# Altium schematic sheet RPL_POWER_24V.SchDoc: POWER MANAGMENT
size A; DrawnBy: Seyed Omid Hasanli; Organization: RPL; Revision: 1
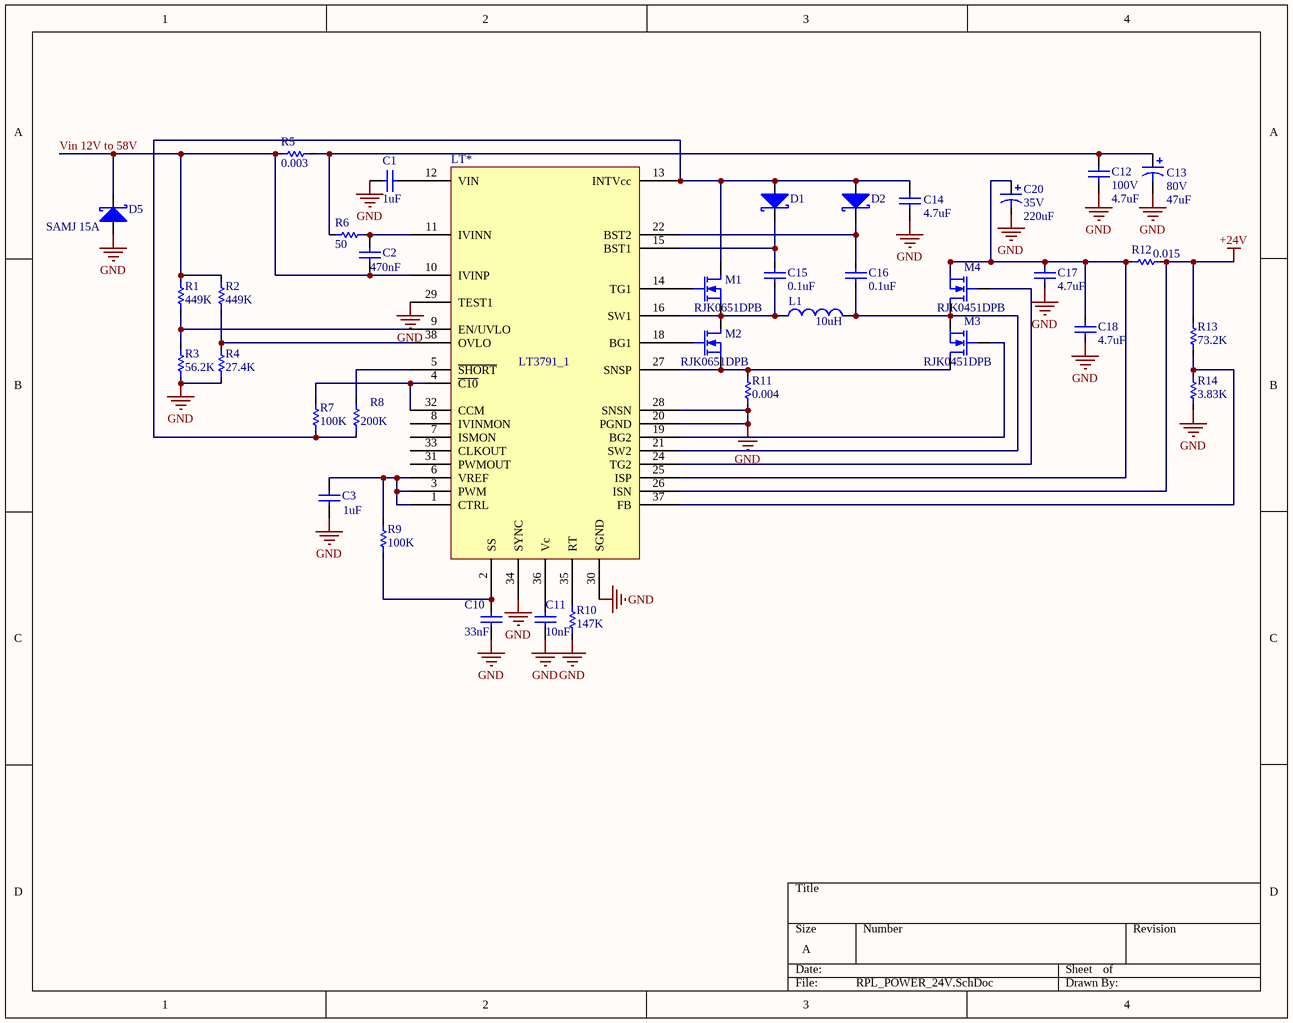
[diagram p0: RPL_POWER_24V.SchDoc]

## Parts
C1  value 1uF  [C1206]  (hidden comment: Cap Semi)
C2  value 470nF  [C1206]  (hidden comment: Cap Semi)
C3  value 1uF  [C1206]  (hidden comment: Cap Semi)
C10  value 33nF  [C1206]  (hidden comment: Cap Semi)
C11  value 10nF  [C1206]  (hidden comment: Cap Semi)
C12  100V  value 4.7uF  [C1206]
C13  80V  value 47uF  [C0805]
C14  value 4.7uF  [C1206]  (hidden comment: Cap Semi)
C15  value 0.1uF  (hidden comment: Cap)
C16  value 0.1uF  (hidden comment: Cap)
C17  value 4.7uF  (hidden comment: 50V)
C18  value 4.7uF  (hidden comment: 50V)
C20  35V  value 220uF
D1  Diod  (value not drawn)
D2  Diod  (value not drawn)
D5  SAMJ 15A
L1  value 10uH  (hidden comment: Inductor)
LT*  LT3791_1
M1  RJK0651DPB
M2  RJK0651DPB
M3  RJK0451DPB
M4  RJK0451DPB
R1  value 449K  (hidden comment: Res)
R2  value 449K  (hidden comment: Res)
R3  value 56.2K  (hidden comment: Res)
R4  value 27.4K  (hidden comment: Res)
R5  value 0.003  (hidden comment: Res)
R6  value 50  (hidden comment: Res)
R7  value 100K  (hidden comment: Res)
R8  value 200K  (hidden comment: Res)
R9  value 100K  (hidden comment: Res)
R10  value 147K  (hidden comment: 200KHz)
R11  value 0.004  (hidden comment: Res)
R12  value 0.015  (hidden comment: Res)
R13  value 73.2K  (hidden comment: Res)
R14  value 3.83K  (hidden comment: Res)

## Nets
+24V: LT*.26(ISN) R12.2 R13.2
GND: C1.2 C3.1 C10.1 C11.1 C12.1 C13.2 C14.1 C17.1 C18.1 C20.2 D5.1(A) LT*.20(PGND) LT*.28(SNSN) LT*.29(TEST1) LT*.30(SGND) LT*.34(SYNC) R3.1 R4.1 R10.1 R11.1 R14.1
Vin 12V to 58V: C2.1 D5.3(K) LT*.10(IVINP) R1.2 R2.2 R5.1
NetC1_1: C1.1 LT*.12(VIN)
NetC2_2: C2.2 LT*.11(IVINN) R6.2
NetC3_2: C3.2 LT*.1(CTRL) LT*.3(PWM) LT*.6(VREF) R9.2
NetC10_2: C10.2 LT*.2(SS) R9.1
NetC11_2: C11.2 LT*.36(Vc)
NetC12_2: C12.2 C13.1 R5.2 R6.1
NetC14_2: C14.2 D1.1(A) D2.1(A) LT*.13(INTVcc) M1.1(D) R7.1 R8.1
NetC15_1: C15.1 L1.1 LT*.16(SW1) M1.3(S) M2.1(D)
NetC15_2: C15.2 D1.3(K) LT*.15(BST1)
NetC16_1: C16.1 L1.2 LT*.21(SW2) M3.3(S) M4.1(D)
NetC16_2: C16.2 D2.3(K) LT*.22(BST2)
NetC17_2: C17.2 C18.2 C20.1 LT*.25(ISP) M4.3(S) R12.1
NetLT*_4: LT*.4(~{C10}) LT*.32(CCM) R7.2
NetLT*_5: LT*.5(~{SHORT}) R8.2
NetLT*_9: LT*.9(EN/UVLO) R1.1 R3.2
NetLT*_14: LT*.14(TG1) M1.2(G)
NetLT*_18: LT*.18(BG1) M2.2(G)
NetLT*_19: LT*.19(BG2) M3.2(G)
NetLT*_24: LT*.24(TG2) M4.2(G)
NetLT*_27: LT*.27(SNSP) M2.3(S) M3.1(D) R11.2
NetLT*_35: LT*.35(RT) R10.2
NetLT*_37: LT*.37(FB) R13.1 R14.2
NetLT*_38: LT*.38(OVLO) R2.1 R4.2

Not connected (* = marked no-connect by the designer): LT* 7(ISMON) 8(IVINMON) 31(PWMOUT) 33(CLKOUT)

## Library data of the parts
C1-C3 C10-C12 C14 = Cap Semi: Capacitor (Semiconductor SIM Model); Published: 8-Jun-2000; LatestRevisionDate: 29-May-2009; LatestRevisionNote: IPC-7351 Footprint Added.; PackageReference: C1206; Publisher: Altium Limited; PackageDescription: Chip Capacitor
C13 = Cap Pol3: Polarized Capacitor (Surface Mount); Published: 8-Jun-2000; LatestRevisionDate: 29-May-2009; LatestRevisionNote: IPC-7351 Footprint Added.; PackageReference: C0805; Publisher: Altium Limited; PackageDescription: Chip Capacitor
C17 C18 = Cap
C20 = Cap Elec
D5 = Diod
M1-M4 = Mosfet
R10 = Res